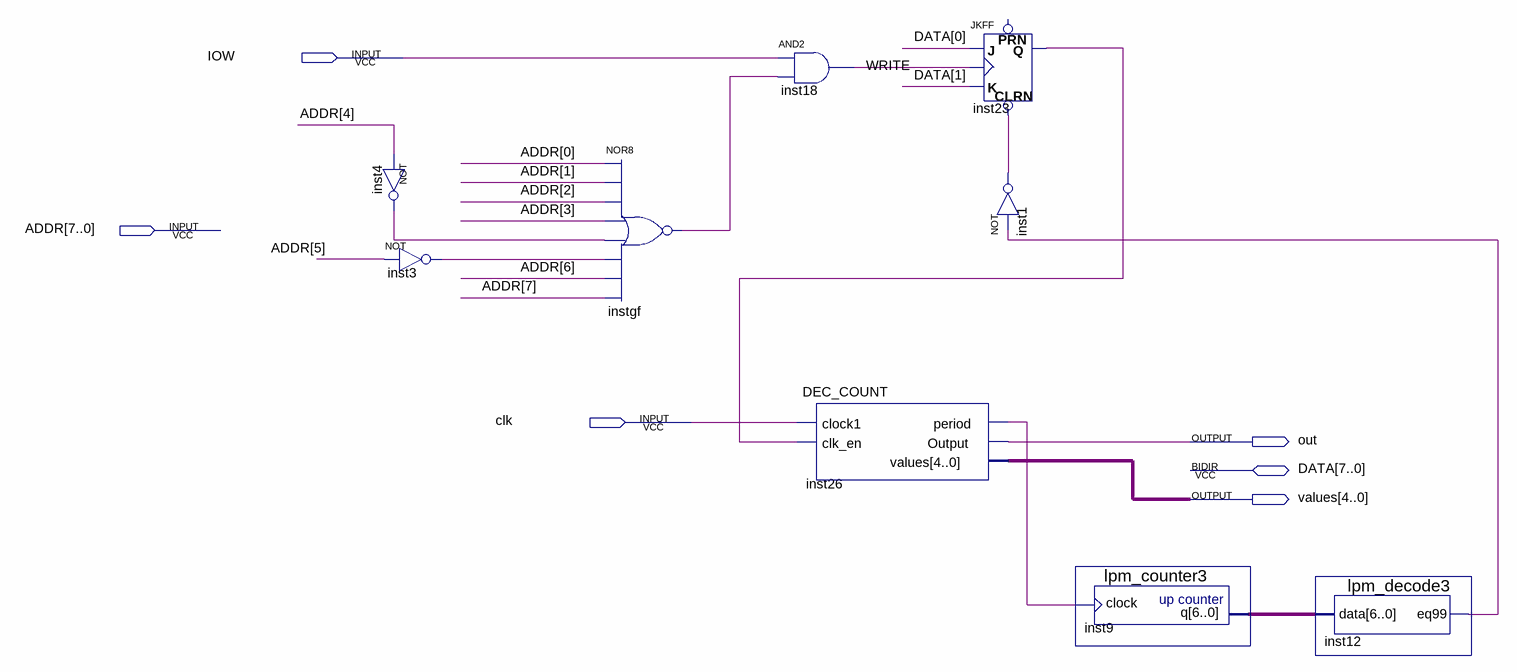
[diagram p0: schematic sheet]
// Quartus schematic interface_2.bdf as structural Verilog: 9 symbols, 6 pins
module interface_2 (
  input  IOW,
  input  [7:0] ADDR,
  input  clk,
  inout  [7:0] DATA,
  output out,
  output [4:0] values
);

  wire inst1_out, inst3_out, inst4_out, inst12_eq99, inst23_q, inst26_period, instgf_out, WRITE;
  wire [6:0] inst9_q;

  not inst4 (inst4_out, ADDR[4]);
  not inst3 (inst3_out, ADDR[5]);
  nor instgf (instgf_out, ADDR[0], ADDR[1], ADDR[2], ADDR[3], inst4_out, inst3_out, ADDR[6], ADDR[7]);
  and inst18 (WRITE, IOW, instgf_out);
  DEC_COUNT inst26 (.clock1(clk), .clk_en(inst23_q), .period(inst26_period), .Output(out), .values(values));
  JKFF inst23 (.CLRN(inst1_out), .K(DATA[1]), .J(DATA[0]), .CLK(WRITE), .Q(inst23_q));  // open: PRN
  not inst1 (inst1_out, inst12_eq99);
  lpm_counter3 inst9 (.clock(inst26_period), .q(inst9_q));
  lpm_decode3 inst12 (.data(inst9_q), .eq99(inst12_eq99));
endmodule
